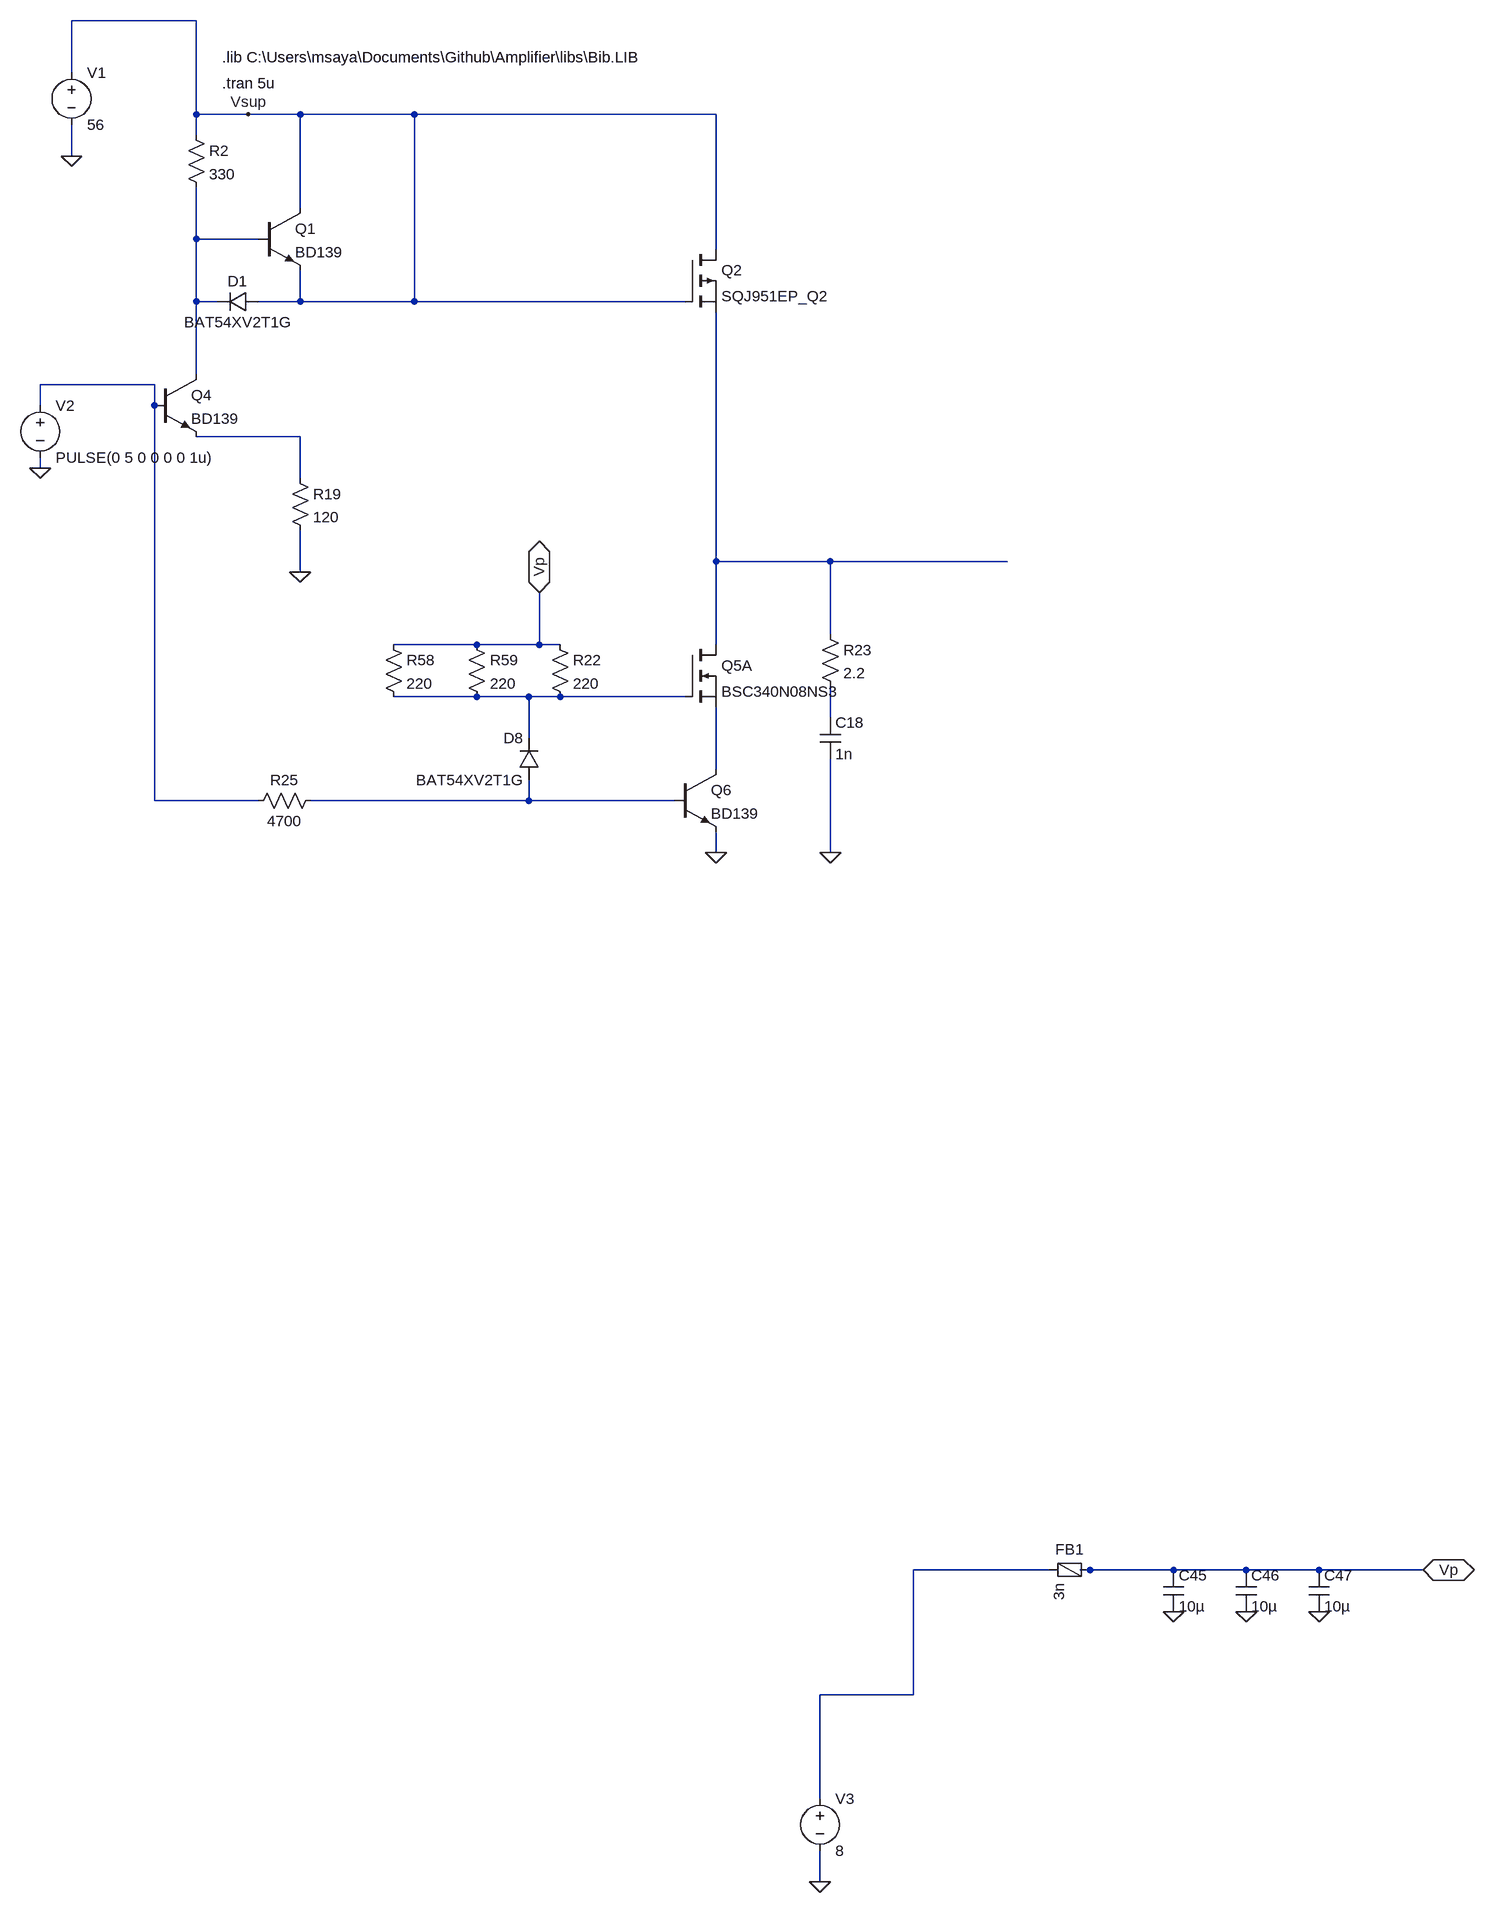
[diagram p0: schematic pulse Amplifier.asc]
pulse Amplifier.asc, the LTspice schematic file:
Version 4
SHEET 1 4920 2468
WIRE 192 -416 0 -416
WIRE 0 -336 0 -416
WIRE 192 -272 192 -416
WIRE 272 -272 192 -272
WIRE 352 -272 272 -272
WIRE 528 -272 352 -272
WIRE 992 -272 528 -272
WIRE 192 -240 192 -272
WIRE 0 -208 0 -256
WIRE 352 -128 352 -272
WIRE 192 -80 192 -160
WIRE 288 -80 192 -80
WIRE 992 -64 992 -272
WIRE 192 16 192 -80
WIRE 224 16 192 16
WIRE 352 16 352 -32
WIRE 352 16 288 16
WIRE 528 16 528 -272
WIRE 528 16 352 16
WIRE 944 16 528 16
WIRE 192 128 192 16
WIRE 128 144 -48 144
WIRE -48 176 -48 144
WIRE 128 176 128 144
WIRE 352 224 192 224
WIRE -48 272 -48 256
WIRE 352 288 352 224
WIRE 992 416 992 32
WIRE 1168 416 992 416
WIRE 1440 416 1168 416
WIRE 352 432 352 368
WIRE 1168 528 1168 416
WIRE 624 544 496 544
WIRE 720 544 720 464
WIRE 720 544 624 544
WIRE 752 544 720 544
WIRE 992 544 992 416
WIRE 624 624 496 624
WIRE 704 624 624 624
WIRE 752 624 704 624
WIRE 944 624 752 624
WIRE 1168 656 1168 608
WIRE 704 688 704 624
WIRE 992 736 992 640
WIRE 128 784 128 176
WIRE 288 784 128 784
WIRE 704 784 704 752
WIRE 704 784 368 784
WIRE 928 784 704 784
WIRE 992 864 992 832
WIRE 1168 864 1168 720
WIRE 1504 1968 1296 1968
WIRE 1568 1968 1552 1968
WIRE 1696 1968 1568 1968
WIRE 1808 1968 1696 1968
WIRE 1920 1968 1808 1968
WIRE 2080 1968 1920 1968
WIRE 1296 2160 1296 1968
WIRE 1296 2160 1152 2160
WIRE 1152 2320 1152 2160
WIRE 1152 2448 1152 2400
FLAG 352 432 0
FLAG 0 -208 0
FLAG 1168 864 0
FLAG 992 864 0
FLAG 272 -272 Vsup
FLAG 1920 2032 0
FLAG 1808 2032 0
FLAG 1696 2032 0
FLAG 2080 1968 Vp
IOPIN 2080 1968 BiDir
FLAG 720 464 Vp
IOPIN 720 464 BiDir
FLAG -48 272 0
FLAG 1152 2448 0
SYMBOL voltage 0 -352 R0
WINDOW 123 0 0 Left 0
WINDOW 39 0 0 Left 0
SYMATTR InstName V1
SYMATTR Value 56
SYMBOL res 176 -256 R0
SYMATTR InstName R2
SYMATTR Value 330
SYMATTR SpiceLine pwr=0.5
SYMBOL pmos 944 -64 R0
SYMATTR InstName Q2
SYMATTR Value SQJ951EP_Q2
SYMBOL nmos 944 544 R0
SYMATTR InstName Q5A
SYMATTR Value BSC340N08NS3
SYMBOL diode 720 752 R180
WINDOW 0 24 64 Left 2
WINDOW 3 24 0 Left 2
SYMATTR InstName D8
SYMATTR Value BAT54XV2T1G
SYMBOL res 480 528 R0
SYMATTR InstName R58
SYMATTR Value 220
SYMATTR SpiceLine pwr=0.5
SYMBOL res 608 528 R0
SYMATTR InstName R59
SYMATTR Value 220
SYMATTR SpiceLine pwr=0.5
SYMBOL res 736 528 R0
SYMATTR InstName R22
SYMATTR Value 220
SYMATTR SpiceLine pwr=0.5
SYMBOL res 384 768 R90
WINDOW 0 0 56 VBottom 2
WINDOW 3 32 56 VTop 2
SYMATTR InstName R25
SYMATTR Value 4700
SYMBOL res 336 272 R0
SYMATTR InstName R19
SYMATTR Value 120
SYMBOL res 1152 512 R0
SYMATTR InstName R23
SYMATTR Value 2.2
SYMBOL cap 1152 656 R0
SYMATTR InstName C18
SYMATTR Value 1n
SYMBOL npn 288 -128 R0
SYMATTR InstName Q1
SYMATTR Value BD139
SYMBOL npn 128 128 R0
SYMATTR InstName Q4
SYMATTR Value BD139
SYMBOL npn 928 736 R0
SYMATTR InstName Q6
SYMATTR Value BD139
SYMBOL diode 288 0 R90
WINDOW 0 0 32 VBottom 2
WINDOW 3 32 32 VTop 2
SYMATTR InstName D1
SYMATTR Value BAT54XV2T1G
SYMBOL cap 1904 1968 R0
SYMATTR InstName C47
SYMATTR Value 10µ
SYMBOL cap 1792 1968 R0
SYMATTR InstName C46
SYMATTR Value 10µ
SYMBOL cap 1680 1968 R0
SYMATTR InstName C45
SYMATTR Value 10µ
SYMBOL FerriteBead 1536 1968 R90
WINDOW 0 -16 0 VBottom 2
SYMATTR InstName FB1
SYMATTR Value 3n
SYMATTR SpiceLine Ipk=2 Rser=0.064 Rpar=620 Cpar=1.1p mfg="Würth Elektronik" pn="782763621 WE-CBA 1206"
SYMBOL voltage -48 160 R0
WINDOW 123 0 0 Left 0
WINDOW 39 0 0 Left 0
SYMATTR InstName V2
SYMATTR Value PULSE(0 5 0 0 0 0 1u)
SYMBOL voltage 1152 2304 R0
WINDOW 123 0 0 Left 0
WINDOW 39 0 0 Left 0
SYMATTR InstName V3
SYMATTR Value 8
TEXT 232 -320 Left 2 !.tran 5u
TEXT 232 -360 Left 2 !.lib C:\\Users\\msaya\\Documents\\Github\\Amplifier\\libs\\Bib.LIB

The netlist it stands for:
* pulse Amplifier.asc
V1 Vsup 0 56
R2 Vsup N001 330 pwr=0.5
M§Q2 Vsup Vsup N004 N004 SQJ951EP_Q2
M§Q5A N004 N005 N007 N007 BSC340N08NS3
D8 N008 N005 BAT54XV2T1G
R58 Vp N005 220 pwr=0.5
R59 Vp N005 220 pwr=0.5
R22 Vp N005 220 pwr=0.5
R25 N008 N002 4700
R19 N003 0 120
R23 N004 N006 2.2
C18 N006 0 1n
Q1 Vsup N001 Vsup 0 BD139
Q4 N001 N002 N003 0 BD139
Q6 N007 N008 0 0 BD139
D1 Vsup N001 BAT54XV2T1G
C47 Vp 0 10µ
C46 Vp 0 10µ
C45 Vp 0 10µ
L§FB1 Vp N009 3n Ipk=2 Rser=0.064 Rpar=620 Cpar=1.1p mfg="Würth Elektronik" pn="782763621 WE-CBA 1206"
V2 N002 0 PULSE(0 5 0 0 0 0 1u)
V3 N009 0 8
.model D D
.lib standard.dio
.model NPN NPN
.model PNP PNP
.lib standard.bjt
.model NMOS NMOS
.model PMOS PMOS
.lib standard.mos
.tran 5u
.lib C:\Users\msaya\Documents\Github\Amplifier\libs\Bib.LIB
.backanno
.end